# EAGLE design 28pws (EAGLE 7.2.0)
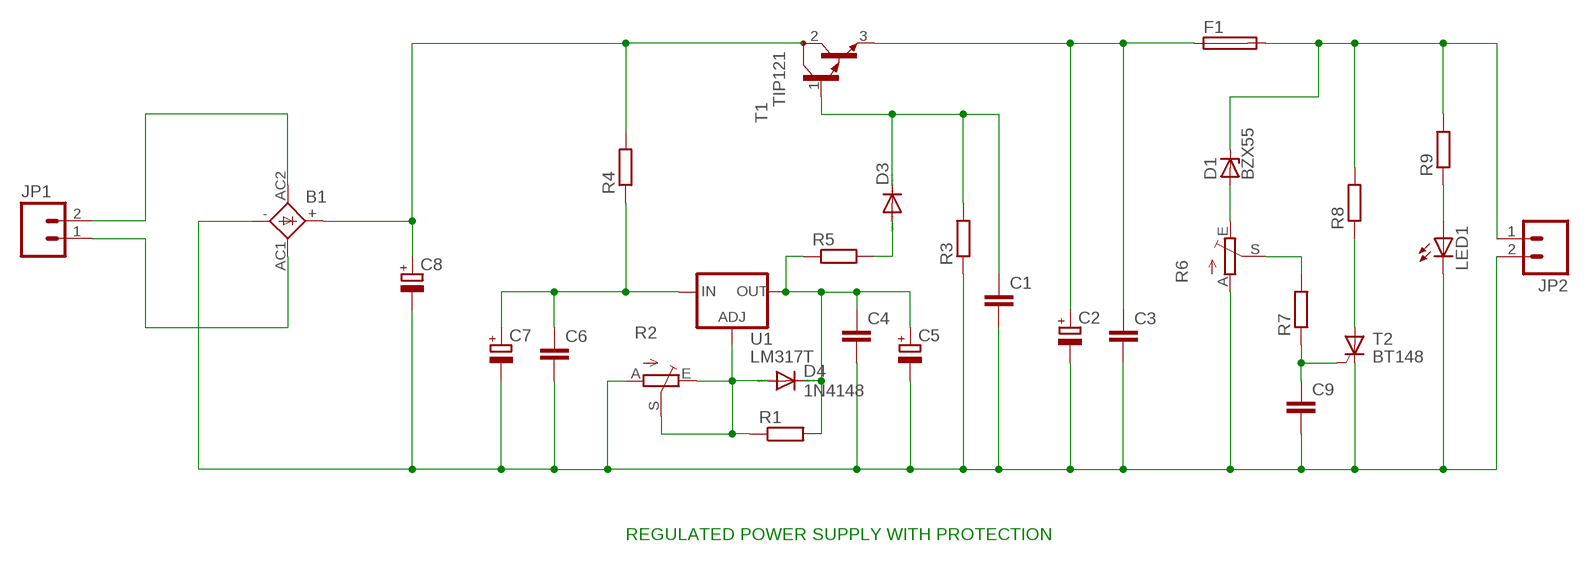
[diagram p0: schematic, sheet 1]

## Parts
B1  GBU4S  [GBU4S]
C1  C-EU025-025X050  [C025-025X050]
C2  CPOL-EUE5-13  [E5-13]
C3  C-EU025-025X050  [C025-025X050]
C4  C-EU025-025X050  [C025-025X050]
C5  CPOL-EUE2.5-5  [E2,5-5]
C6  C-EU025-025X050  [C025-025X050]
C7  CPOL-EUE2.5-5  [E2,5-5]
C8  CPOL-EUE7.5-16  [E7,5-16]
C9  C-EU025-025X050  [C025-025X050]
D1  BZX55  [DO35Z10]
D3  DIODE-DO41-7.6  [DO41-7.6]
D4  1N4148  1N4148DO35-7  [DO35-7]
F1  19560  [19560]
JP1  M02POGO_PIN_HOLES_ONLY  [1X02_PP_HOLES_ONLY]
JP2  M02POGO_PIN_HOLES_ONLY  [1X02_PP_HOLES_ONLY]
LED1  LED5MM  [LED5MM]
R1  R-EU_0204/7  [0204/7]
R2  TRIM_EU-RJ9W  [RJ9W]
R3  R-EU_0204/2V  [0204V]
R4  R-EU_0411/3V  [0411V]
R5  R-EU_0204/2V  [0204V]
R6  TRIM_EU-B25P  [B25P]
R7  R-EU_0207/10  [0207/10]
R8  R-EU_VTA54  [VTA54]
R9  R-EU_0204/7  [0204/7]
T1  TIP121  TIP122  [TO220]
T2  BT148  [SOT82S]
U1  LM317T  V_REG_317SINK  [TO220-ADJ]

## Nets
GND: B1.- C1.2 C2.- C3.2 C4.2 C5.- C6.2 C7.- C8.- C9.2 JP2.2 LED1.K(C) R2.A R3.1 R6.A T2.C
N$1: C1.1 D3.C R3.2 T1.1(B)
N$2: D1.C F1.2 JP2.1 R8.2 R9.2
N$3: R6.S R7.2
N$4: C2.+ C3.1 F1.1 T1.3(E)
N$6: C4.1 C5.+ D4.C R1.2 R5.1 U1.OUT
N$7: C6.1 C7.+ R4.1 U1.IN
N$8: D4.A R1.1 R2.E R2.S U1.ADJ
N$9: B1.AC2(AC1) JP1.2
N$10: D3.A R5.2
N$11: B1.+ C8.+ R4.2 T1.2(C)
N$12: B1.AC1(AC2) JP1.1
N$13: C9.1 R7.1 T2.G
N$14: D1.A R6.E
N$15: LED1.A R9.1
N$16: R8.1 T2.A

## Notes on the sheet
- REGULATED POWER SUPPLY WITH PROTECTION

## Library data of the parts
B1 = rectifier:GBU4S: GENERAL INSTRUMENT RECTIFIER
C1 C3 C4 C6 C9 = rcl:C-EU: CAPACITOR, European symbol
C2 C5 C7 = resistor:CPOL-EU: POLARIZED CAPACITOR, European symbol
C8 = rcl:CPOL-EU: POLARIZED CAPACITOR, European symbol
D1 = diode:BZX55: Z DIODE
D3 = diode:DIODE-: DIODE
D4 = diode:1N4148: DIODE high speed (Philips)
F1 = fuse:19560: FUSE HOLDER TR5, Wickmann; MPN: 56000001009; OC_FARNELL: 1185363; OC_NEWARK: 15P8392
JP1 JP2 = SparkFun-Connectors:M02: Standard 2-pin 0.1" header. Use with - straight break away headers ( PRT-00116) - right angle break away headers (PRT-00553) - swiss pins (PRT-00743) - machine pins (PRT-00117) - female headers (PRT-00115) Molex polarized connector foot print use with: PRT-08233 with associated crimp pins and housings. 2.54_SCREWTERM for use with PRT-10571. 3.5mm Screw Terminal footprints for PRT-08084 5mm Screw Terminal footprints for use with PRT-08432
LED1 = led:LED: LED OSRAM: - CHIPLED LG R971, LG N971, LY N971, LG Q971, LY Q971, LO R971, LY R971 LH N974, LH R974 LS Q976, LO Q976, LY Q976 LO Q996 - Hyper CHIPLED LW Q18S LB Q993, LB Q99A, LB R99A - SideLED LS A670, LO A670, LY A670, LG A670, LP A670 LB A673, LV A673, LT A673, LW A673 LH A674 LY A675 LS A676, LA A676, LO A676, LY A676, LW A676 LS A679, LY A679, LG A679 - Hyper Micro SIDELED® LS Y876, LA Y876, LO Y876, LY Y876 LT Y87S - SmartLED LW L88C, LW L88S LB L89C, LB L89S, LG L890 LS L89K, LO L89K, LY L89K LS L896, LA L896, LO L896, LY L896 - TOPLED LS T670, LO T670, LY T670, LG T670, LP T670 LSG T670, LSP T670, LSY T670, LOP T670, LYG T670 LG T671, LOG T671, LSG T671 LB T673, LV T673, LT T673, LW T673 LH T674 LS T676, LA T676, LO T676, LY T676, LB T676, LH T676, LSB T676, LW T676 LB T67C, LV T67C, LT T67C, LS T67K, LO T67K, LY T67K, LW E67C LS E67B, LA E67B, LO E67B, LY E67B, LB E67C, LV E67C, LT E67C LW T67C LS T679, LY T679, LG T679 LS T770, LO T770, LY T770, LG T770, LP T770 LB T773, LV T773, LT T773, LW T773 LH T774 LS E675, LA E675, LY E675, LS T675 LS T776, LA T776, LO T776, LY T776, LB T776 LHGB T686 LT T68C, LB T68C - Hyper Mini TOPLED® LB M676 - Mini TOPLED Santana® LG M470 LS M47K, LO M47K, LY M47K Source: http://www.osram.convergy.de LUXEON: - LUMILED® LXK2-PW12-R00, LXK2-PW12-S00, LXK2-PW14-U00, LXK2-PW14-V00 LXK2-PM12-R00, LXK2-PM12-S00, LXK2-PM14-U00 LXK2-PE12-Q00, LXK2-PE12-R00, LXK2-PE12-S00, LXK2-PE14-T00, LXK2-PE14-U00 LXK2-PB12-K00, LXK2-PB12-L00, LXK2-PB12-M00, LXK2-PB14-N00, LXK2-PB14-P00, LXK2-PB14-Q00 LXK2-PR12-L00, LXK2-PR12-M00, LXK2-PR14-Q00, LXK2-PR14-R00 LXK2-PD12-Q00, LXK2-PD12-R00, LXK2-PD12-S00 LXK2-PH12-R00, LXK2-PH12-S00 LXK2-PL12-P00, LXK2-PL12-Q00, LXK2-PL12-R00 Source: www.luxeon.com KINGBRIGHT: KA-3528ASYC Source: www.kingbright.com
R1 R4 R9 = resistor:R-EU_: RESISTOR, European symbol
R2 R6 = pot:TRIM_EU-: POTENTIOMETER
R3 R5 R7 R8 = rcl:R-EU_: RESISTOR, European symbol
T1 = transistor:TIP122: NPN BIPOLAR DARLINGTON TRANSISTOR
T2 = triac:BT148: THYRISTOR
U1 = SparkFun-PowerIC:V_REG_317: Voltage Regulator Standard LM317 adjustable voltage regulator. AOI (Adjust Output Input). Google 'LM317 Calculator' for easy to use app to get the two resistor values needed. 240/720 for 5V output. 240/390 for 3.3V output. Spark Fun Electronics SKU : COM-00527

## Board
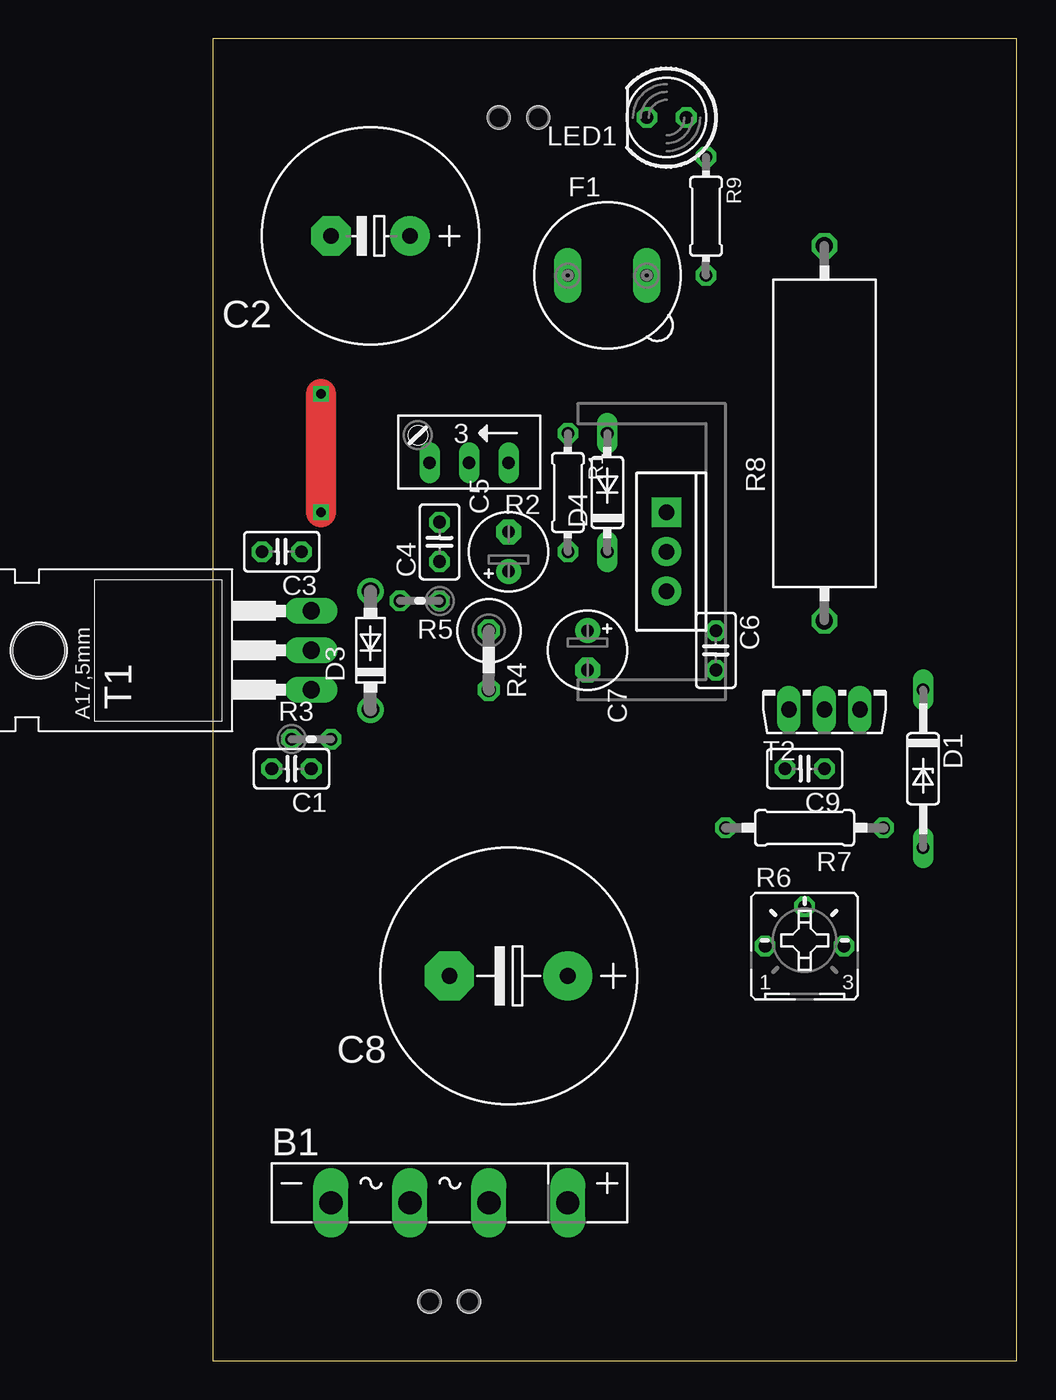
[diagram p1: board, top side]
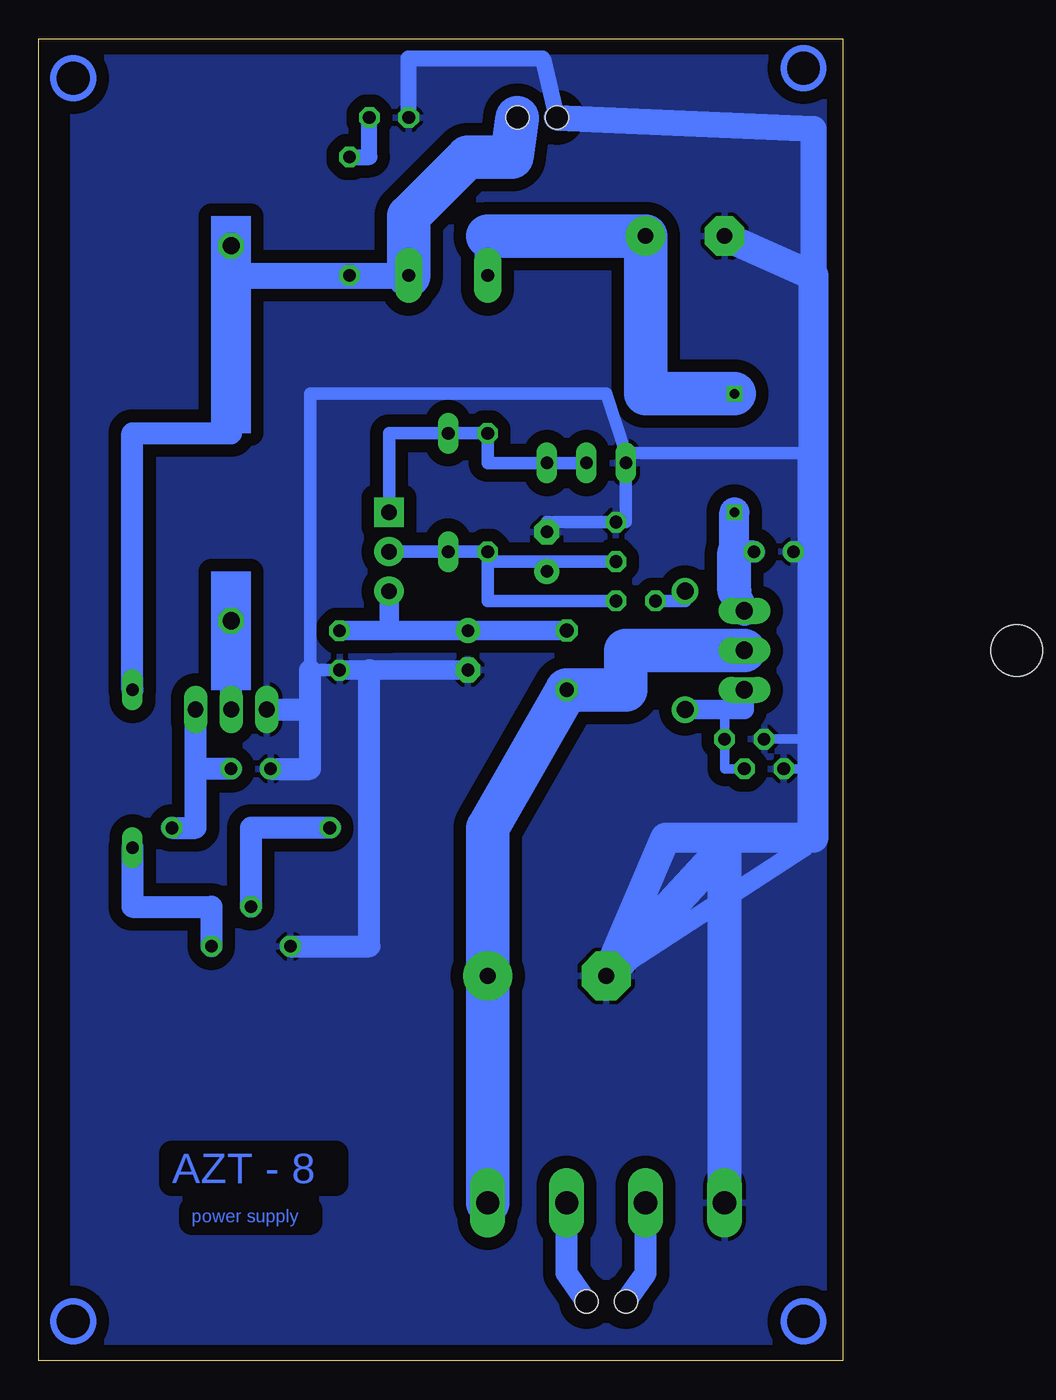
[diagram p2: board, bottom side, seen from below]

Size 51.74 x 85.08 mm. Coordinates in mm from the lower left corner, seen from the top.
Outline: 0,0 51.74,0 51.74,85.08 0,85.08 0,0
Copper layers (1*16): Top 0.035mm / dielectric 1.5mm / Bottom 0.035mm
Design rules "default": minimum track width 10mil, minimum drill 24mil, track to track 8mil, track to pad 8mil, pad to pad 8mil, via to via 8mil, smd to smd 8mil, copper to edge 40mil, drill to drill 8mil, minimum pad ring 10mil, minimum via ring 8mil, stop-mask expansion 4mil, vias tented up to drill 0mil, thermal gap 10mil

### Footprints (pad centres in the part's own frame; a part is rotated, then mirrored left to right if it is on the bottom)
GBU4S = drill 1.499 long: + 7.62,0; - -7.62,0; AC1 2.54,0; AC2 -2.54,0
C025-025X050 = drill 0.813 octagon: 1 -1.27,0; 2 1.27,0
E5-13 = drill 1.016 pad 2.54: + -2.54,0 | drill 1.016 pad 2.54 octagon: - 2.54,0
E2,5-5 = drill 0.813 pad 1.6: + -1.27,0 | drill 0.813 pad 1.6 octagon: - 1.27,0
E7,5-16 = drill 1.016 pad 3.15: + -3.81,0 | drill 1.016 pad 3.15 octagon: - 3.81,0
DO35Z10 = drill 0.813 long: A 5.08,0; C -5.08,0
DO41-7.6 = drill 1.1 pad 1.7: A 3.81,0; C -3.81,0
DO35-7 = drill 0.813 long: A 3.81,0; C -3.81,0
19560 = drill 0.813 pad 1.778 long: 1 -2.54,0; 2 2.54,0
1X02_PP_HOLES_ONLY = drill 0.889 pad 0.813: 1 0,0; 2 2.54,0 | hole 1.473: 0,0; 2.54,0
LED5MM = drill 0.813 octagon: A -1.27,0; K 1.27,0
0204/7 = drill 0.813 octagon: 1 -3.81,0; 2 3.81,0
RJ9W = drill 0.813 long: A 2.54,0.635; E -2.54,0.635; S 0,0.635
0204V = drill 0.813 octagon: 1 -1.27,0; 2 1.27,0
0411V = drill 0.914 octagon: 1 -2.54,0; 2 1.27,0
B25P = drill 0.813 octagon: A -2.54,0; E 2.54,0; S 0,2.54
0207/10 = drill 0.813 octagon: 1 -5.08,0; 2 5.08,0
VTA54 = drill 1.1 octagon: 1 -12.065,0; 2 12.065,0
TO220 = drill 1.118 long: 1 -2.54,-6.35; 2 0,-6.35; 3 2.54,-6.35 | hole 3.302: 0,11.176
SOT82S = drill 1.016 long: A 0,-1.27; C -2.286,-1.27; G 2.286,-1.27
TO220-ADJ = drill 1 pad 1.88 square: ADJ -2.54,0 | drill 1 pad 1.88: IN 2.54,0; OUT 0,0

### Placement (x,y rotation side)
B1  15.24,10.16 0 top
C1  5.08,38.1 180 top
C2  10.16,72.39 180 top
C3  4.45,52.07 180 top
C4  14.61,52.7 90 top
C5  19.05,52.07 90 top
C6  32.38,45.72 270 top
C7  24.13,45.72 270 top
C8  19.05,24.77 180 top
C9  38.1,38.1 180 top
D1  45.72,38.1 270 top
D3  10.16,45.72 90 top
D4  25.4,55.88 90 top
F1  25.4,69.85 0 top
JP1  16.51,3.81 180 top
JP2  20.95,80.01 180 top
LED1  29.21,80.01 180 top
R1  22.86,55.88 270 top
R2  16.51,58.42 180 top
R3  6.35,40 0 top
R4  17.78,44.45 270 top
R5  13.34,48.89 180 top
R6  38.1,26.67 0 top
R7  38.1,34.29 180 top
R8  39.37,59.69 90 top
R9  31.75,73.66 270 top
T1  0,45.72 90 top
T2  39.37,43.18 0 top
U1  29.21,52.07 270 top

### Tracks (layer width: path | path; a pad name or v marks a point on that pad's centre or on a via)
GND
  Bottom 0.61: R3.1 2.54,40 | C1.2 2.54,38.1
  Bottom 0.813: C5.- 19.05,53.98 C4.2 13.97,53.98 R2.A 13.97,58.42 | C6.2 34.29,44.45 34.29,62.23 15.24,62.23 13.97,58.42 | 2.54,33.02 2.54,38.1 2.54,40 2.54,52.07 2.54,58.42 13.97,58.42
  Bottom 1.016: LED1.K 27.94,83.82 19.32,83.82 JP2.2
  Bottom 1.27: C6.2 30.48,44.45 C7.- | C8.- 2.54,33.02
  Bottom 1.422: C3.2 2.54,52.07 | T2.C 34.29,41.91 | 34.29,41.91 34.29,44.45 | C9.2 34.29,38.1 34.29,41.91 | R6.A 30.48,26.67 30.48,44.45
  Bottom 1.676: JP2.2 1.91,79.29 1.91,69.85
  Bottom 1.93: C2.- 1.91,69.85 1.91,33.66 11.43,33.66 C8.-
  Bottom 2.184: B1.- 7.62,33.02 C8.-
  pour Bottom (isolate 0.813): 0,85.09 49.53,85.09 49.53,0 0,0
N$1
  Bottom 0.61: 7.62,41.91 R3.2 7.62,38.1 C1.1
  Bottom 1.27: D3.C 7.62,41.91 6.35,41.91 T1.1
N$2
  Bottom 1.016: R9.2 F1.2
  Bottom 1.422: D1.C 45.72,59.69 39.37,59.69 39.37,71.12
  Bottom 1.676: R8.2 39.37,71.12 39.37,69.85 F1.2
  Bottom 2.794: F1.2 27.94,73.66 24.13,77.47 21.32,77.47 JP2.1
N$3
  Bottom 1.422: R7.2 38.1,34.29 R6.S
N$4  (via drill 0.6)
  Top 1.93: v6.99,54.61 v6.99,62.23
  Bottom 1.422: C3.1 6.99,52.07
  Bottom 1.676: F1.1 22.86,72.39
  Bottom 1.93: T1.3 6.99,49.53 | 6.99,52.07 v6.99,54.61
  Bottom 2.184: 6.99,49.53 6.99,52.07
  Bottom 2.794: v6.99,62.23 12.7,62.23 C2.+ 22.86,72.39
N$6
  Bottom 0.813: R5.1 22.86,48.89 R1.2 | U1.OUT D4.C R1.2 | C5.+ 19.05,51.43 C4.1 22.86,51.43 R1.2
N$7
  Bottom 1.27: R4.1 C7.+ C6.1 29.21,46.99 U1.IN
N$8
  Bottom 0.813: U1.ADJ 29.21,59.69 D4.A R1.1 22.86,57.78 R2.E R2.S
N$9
  Bottom 1.422: JP1.2 12.7,5.63 B1.AC2
N$10
  Bottom 0.813: R5.2 10.16,48.89 D3.A
N$11
  Bottom 2.794: B1.+ C8.+ 22.86,34.29 R4.2 13.97,43.18 13.97,45.72 T1.2
N$12
  Bottom 1.422: JP1.1 17.78,5.63 B1.AC1
N$13
  Bottom 1.422: C9.1 41.66,38.1 | 41.66,38.1 T2.G | R7.1 41.66,34.29 41.66,38.1
N$14
  Bottom 1.422: D1.A 45.72,29.21 40.64,29.21 R6.E
N$15
  Bottom 1.016: R9.1 30.48,77.47 LED1.A
N$16
  Bottom 1.422: T2.A R8.1
(copper drawn outside any net)
  shapes: Bottom area x3, Bottom circle x4

### Text on the board
Bottom: AZT - 8 | power supply